# Altium project Chassis_Controller.PrjPcb
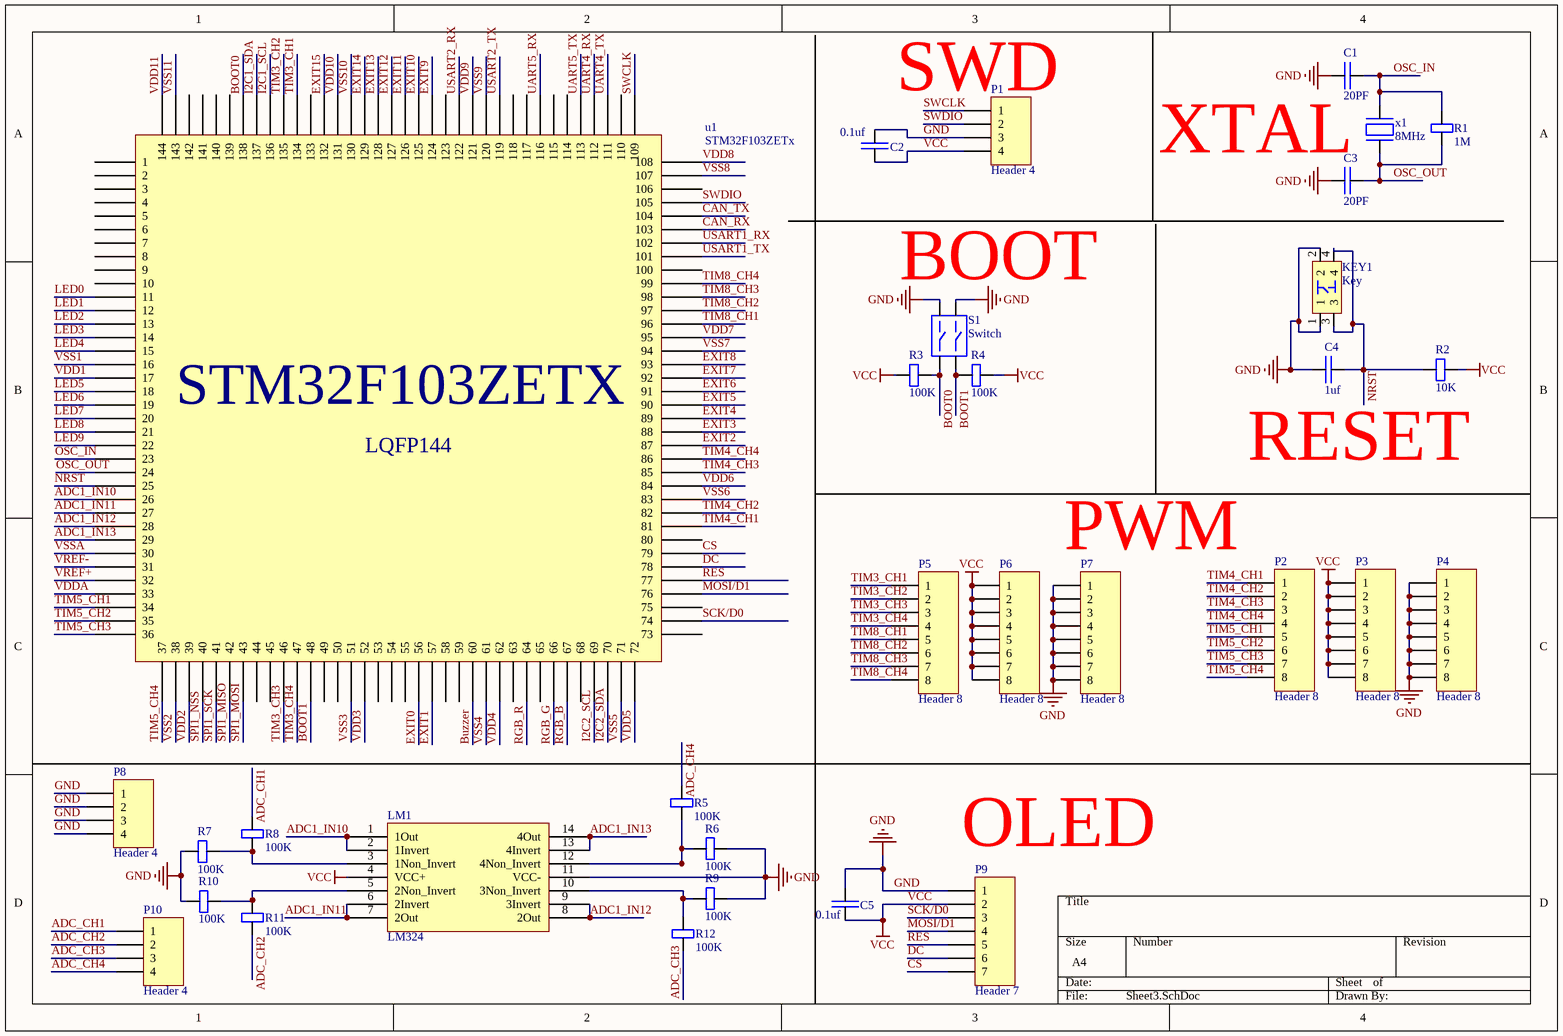
[diagram p0: Sheet3.SchDoc]
1 sheet, 32 parts. Net scope: global (net labels, ports and power ports of the same name join across sheets).
Board files: PCB1.PcbDoc, logo.PcbDoc

## Sheet Sheet3.SchDoc
size A4

### Parts
C1  20PF  [0402]
C2  0.1uf  [0402]
C3  20PF  [0402]
C4  1uf  [0402]
C5  0.1uf  [0402]
KEY1  Key  [6*6*5轻触开关]
LM1  LM324  [LM324]
P1  Header 4  [HDR1X4]
P2  Header 8  [HDR1X8]
P3  Header 8  [HDR1X8]
P4  Header 8  [HDR1X8]
P5  Header 8  [HDR1X8]
P6  Header 8  [HDR1X8]
P7  Header 8  [HDR1X8]
P8  Header 4  [HDR1X4]
P9  Header 7  [HDR1X7]
P10  Header 4  [HDR1X4]
R1  1M  [0402]
R2  10K  [0402]
R3  100K  [0402]
R4  100K  [0402]
R5  100K  [0402]
R6  100K  [0402]
R7  100K  [0402]
R8  100K  [0402]
R9  100K  [0402]
R10  100K  [0402]
R11  100K  [0402]
R12  100K  [0402]
S1  Switch  [SWITCH_2P]
u1  STM32F103ZETx  [STM32F103ZETx]
x1  8MHz  [8M晶振]

### Nets
GND: C1.2 C2.1 C3.2 C4.2 C5.1 KEY1.1 KEY1.2 LM1.11(VCC-) P1.3 P4.1 P4.2 P4.3 P4.4 P4.5 P4.6 P4.7 P4.8 P7.1 P7.2 P7.3 P7.4 P7.5 P7.6 P7.7 P7.8 P8.1 P8.2 P8.3 P8.4 P9.1 R6.1 R7.1 R9.1 R10.1 S1.1 S1.3
VCC: C2.2 C5.2 LM1.4(VCC+) P1.4 P3.1 P3.2 P3.3 P3.4 P3.5 P3.6 P3.7 P3.8 P6.1 P6.2 P6.3 P6.4 P6.5 P6.6 P6.7 P6.8 P9.2 R2.2 R3.2 R4.1
ADC1_IN10: LM1.1(1Out) LM1.2(1Invert) u1.26
ADC1_IN11: LM1.6(2Invert) LM1.7(2Out) u1.27
ADC1_IN12: LM1.8(2Out) LM1.9(3Invert) u1.28
ADC1_IN13: LM1.13(4Invert) LM1.14(4Out) u1.29
ADC_CH1: P10.1 R8.2
ADC_CH2: P10.2 R11.2
ADC_CH3: P10.3 R12.2
ADC_CH4: P10.4 R5.1
BOOT0: R3.1 S1.2 u1.138
BOOT1: R4.2 S1.4 u1.48
Buzzer: u1.60
CAN_RX: u1.103
CAN_TX: u1.104
CS: P9.7 u1.79
DC: P9.6 u1.78
EXIT0: u1.56
EXIT1: u1.57
EXIT2: u1.87
EXIT3: u1.88
EXIT4: u1.89
EXIT5: u1.90
EXIT6: u1.91
EXIT7: u1.92
EXIT8: u1.93
EXIT9: u1.124
EXIT10: u1.125
EXIT11: u1.126
EXIT12: u1.127
EXIT13: u1.128
EXIT14: u1.129
EXIT15: u1.132
I2C1_SCL: u1.136
I2C1_SDA: u1.137
I2C2_SCL: u1.69
I2C2_SDA: u1.70
LED0: u1.11
LED1: u1.12
LED2: u1.13
LED3: u1.14
LED4: u1.15
LED5: u1.18
LED6: u1.19
LED7: u1.20
LED8: u1.21
LED9: u1.22
MOSI/D1: P9.4 u1.76
NRST: C4.1 KEY1.3 KEY1.4 R2.1 u1.25
OSC_IN: C1.1 R1.2 u1.23 x1.1
OSC_OUT: C3.1 R1.1 u1.24 x1.2
RES: P9.5 u1.77
RGB_B: u1.67
RGB_G: u1.66
RGB_R: u1.64
SCK/D0: P9.3 u1.74
SPI1_MISO: u1.42
SPI1_MOSI: u1.43
SPI1_NSS: u1.40
SPI1_SCK: u1.41
SWCLK: P1.1 u1.109
SWDIO: P1.2 u1.105
TIM3_CH1: P5.1 u1.134
TIM3_CH2: P5.2 u1.135
TIM3_CH3: P5.3 u1.46
TIM3_CH4: P5.4 u1.47
TIM4_CH1: P2.1 u1.81
TIM4_CH2: P2.2 u1.82
TIM4_CH3: P2.3 u1.85
TIM4_CH4: P2.4 u1.86
TIM5_CH1: P2.5 u1.34
TIM5_CH2: P2.6 u1.35
TIM5_CH3: P2.7 u1.36
TIM5_CH4: P2.8 u1.37
TIM8_CH1: P5.5 u1.96
TIM8_CH2: P5.6 u1.97
TIM8_CH3: P5.7 u1.98
TIM8_CH4: P5.8 u1.99
UART4_RX: u1.112
UART4_TX: u1.111
UART5_RX: u1.116
UART5_TX: u1.113
USART1_RX: u1.102
USART1_TX: u1.101
USART2_RX: u1.122
USART2_TX: u1.119
VDD1: u1.17
VDD2: u1.39
VDD3: u1.52
VDD4: u1.62
VDD5: u1.72
VDD6: u1.84
VDD7: u1.95
VDD8: u1.108
VDD9: u1.121
VDD10: u1.131
VDD11: u1.144
VDDA: u1.33
VREF+: u1.32
VREF-: u1.31
VSS1: u1.16
VSS2: u1.38
VSS3: u1.51
VSS4: u1.61
VSS5: u1.71
VSS6: u1.83
VSS7: u1.94
VSS8: u1.107
VSS9: u1.120
VSS10: u1.130
VSS11: u1.143
VSSA: u1.30
NetLM1_3: LM1.3(1Non_Invert) R7.2 R8.1
NetLM1_5: LM1.5(2Non_Invert) R10.2 R11.1
NetLM1_10: LM1.10(3Non_Invert) R9.2 R12.1
NetLM1_12: LM1.12(4Non_Invert) R5.2 R6.2

Not connected (* = marked no-connect by the designer): u1 1 2 3 4 5 6 7 8 9 10 44 45 49 50 53 54 55 58 59 63 65 68 73 75 80 100 106 110 114 115 117 118 123 133 139 140 141 142

### Notes on the sheet
- (near P1) SWD
- XTAL
- (near S1) BOOT
- RESET
- (near P7) PWM
- (near P9) OLED
- (in symbol STM32F103ZETx) STM32F103ZETX; LQFP144

### Library data of the parts
C1-C5 = C
P1 P8 P10 = Header 4: Header, 4-Pin; LatestRevisionDate: 17-Jul-2002; LatestRevisionNote: Re-released for DXP Platform.; Publisher: Altium Limited
P2-P7 = Header 8: Header, 8-Pin; LatestRevisionDate: 17-Jul-2002; LatestRevisionNote: Re-released for DXP Platform.; Publisher: Altium Limited
P9 = Header 7: Header, 7-Pin; LatestRevisionDate: 17-Jul-2002; LatestRevisionNote: Re-released for DXP Platform.; Publisher: Altium Limited
R1-R12 = R
x1 = XTAL_8MHz